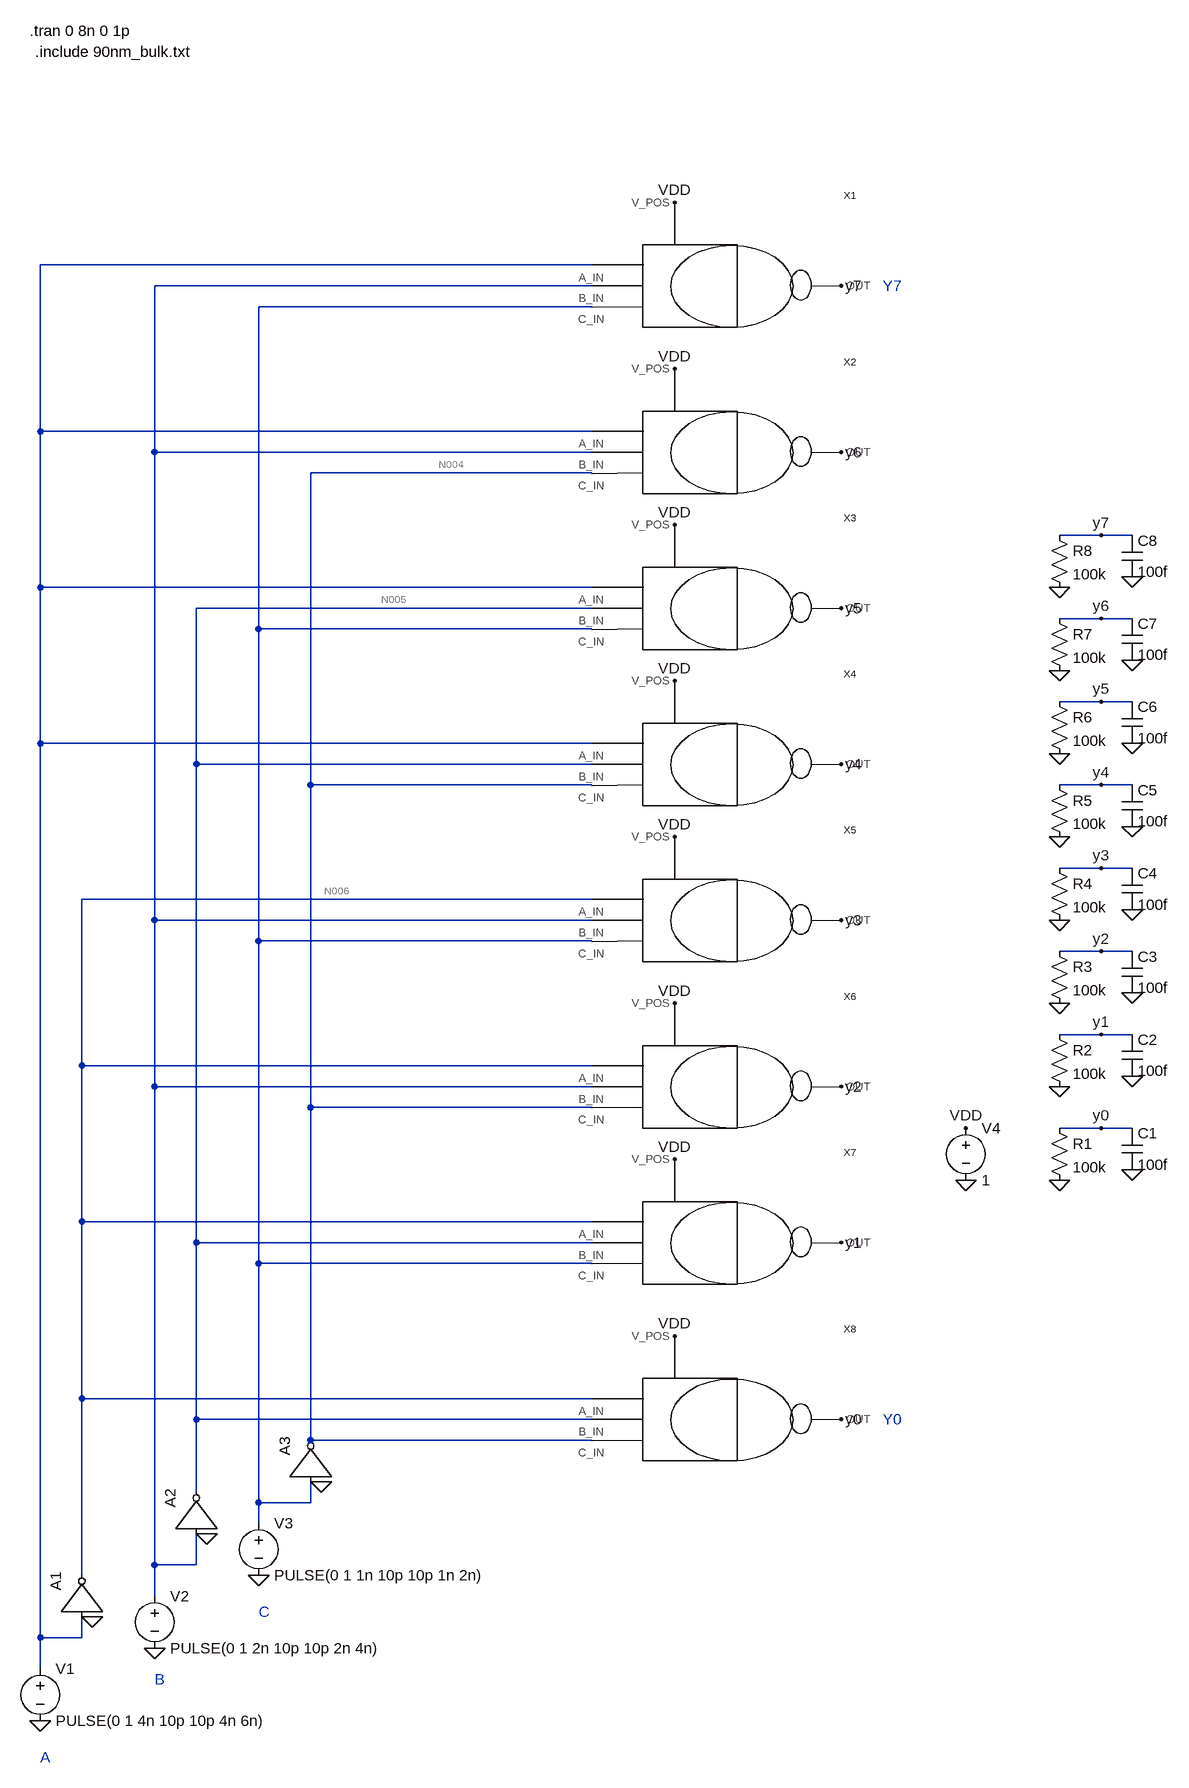
[diagram p0: schematic encoder.asc]
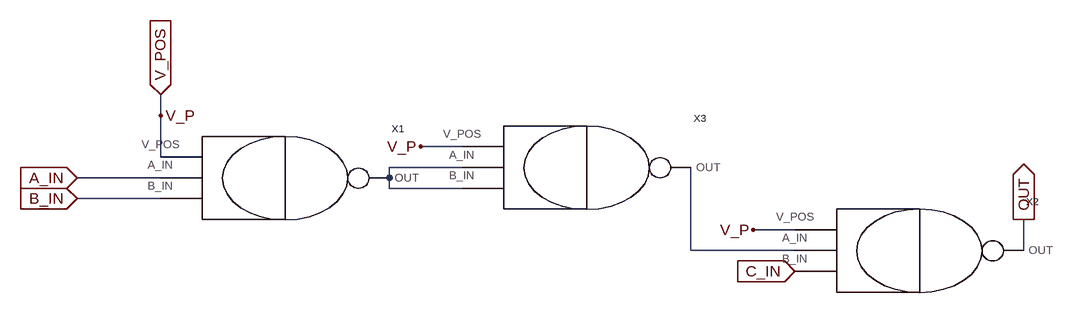
[diagram p1: sub-circuit nand3.asc]
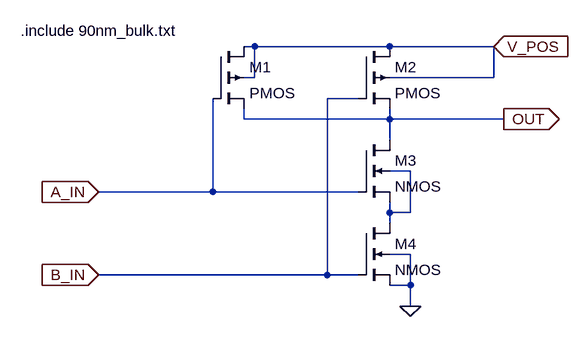
[diagram p2: sub-circuit nand.asc]
encoder.asc, the LTspice schematic file:
Version 4
SHEET 1 2432 2520
WIRE 1360 208 512 208
WIRE 1360 240 688 240
WIRE 1360 272 848 272
WIRE 512 464 512 208
WIRE 1360 464 512 464
WIRE 688 496 688 240
WIRE 1360 496 688 496
WIRE 1360 528 928 528
WIRE 2144 624 2080 624
WIRE 2192 624 2144 624
WIRE 512 704 512 464
WIRE 1360 704 512 704
WIRE 1360 736 752 736
WIRE 2144 752 2080 752
WIRE 2192 752 2144 752
WIRE 848 768 848 272
WIRE 1360 768 848 768
WIRE 2144 880 2080 880
WIRE 2192 880 2144 880
WIRE 512 944 512 704
WIRE 1360 944 512 944
WIRE 752 976 752 736
WIRE 1360 976 752 976
WIRE 928 1008 928 528
WIRE 1360 1008 928 1008
WIRE 2144 1008 2080 1008
WIRE 2192 1008 2144 1008
WIRE 2144 1136 2080 1136
WIRE 2192 1136 2144 1136
WIRE 1360 1184 576 1184
WIRE 688 1216 688 496
WIRE 1360 1216 688 1216
WIRE 848 1248 848 768
WIRE 1360 1248 848 1248
WIRE 2144 1264 2080 1264
WIRE 2192 1264 2144 1264
WIRE 2144 1392 2080 1392
WIRE 2192 1392 2144 1392
WIRE 576 1440 576 1184
WIRE 1360 1440 576 1440
WIRE 688 1472 688 1216
WIRE 1360 1472 688 1472
WIRE 928 1504 928 1008
WIRE 1360 1504 928 1504
WIRE 2144 1536 2080 1536
WIRE 2192 1536 2144 1536
WIRE 576 1680 576 1440
WIRE 1360 1680 576 1680
WIRE 752 1712 752 976
WIRE 1360 1712 752 1712
WIRE 848 1744 848 1248
WIRE 1360 1744 848 1744
WIRE 576 1952 576 1680
WIRE 1360 1952 576 1952
WIRE 752 1984 752 1712
WIRE 1360 1984 752 1984
WIRE 928 2016 928 1504
WIRE 1360 2016 928 2016
WIRE 752 2096 752 1984
WIRE 848 2112 848 1744
WIRE 928 2112 928 2080
WIRE 928 2112 848 2112
WIRE 848 2144 848 2112
WIRE 688 2208 688 1472
WIRE 752 2208 752 2160
WIRE 752 2208 688 2208
WIRE 576 2224 576 1952
WIRE 688 2256 688 2208
WIRE 512 2320 512 944
WIRE 576 2320 576 2288
WIRE 576 2320 512 2320
WIRE 512 2368 512 2320
FLAG 512 2448 0
FLAG 688 2336 0
FLAG 848 2224 0
FLAG 1936 1616 0
FLAG 1936 1536 VDD
FLAG 1488 1856 VDD
FLAG 1488 1584 VDD
FLAG 1488 1344 VDD
FLAG 1488 1088 VDD
FLAG 1488 848 VDD
FLAG 1488 608 VDD
FLAG 1488 368 VDD
FLAG 1488 112 VDD
FLAG 1744 240 y7
FLAG 1744 496 y6
FLAG 1744 736 y5
FLAG 1744 976 y4
FLAG 1744 1216 y3
FLAG 1744 1472 y2
FLAG 1744 1712 y1
FLAG 1744 1984 y0
FLAG 2080 704 0
FLAG 2080 832 0
FLAG 2080 960 0
FLAG 2080 1088 0
FLAG 2080 1216 0
FLAG 2080 1344 0
FLAG 2080 1472 0
FLAG 2080 1616 0
FLAG 2192 1600 0
FLAG 2192 1456 0
FLAG 2192 1328 0
FLAG 2192 1200 0
FLAG 2192 1072 0
FLAG 2192 944 0
FLAG 2192 816 0
FLAG 2192 688 0
FLAG 2144 1536 y0
FLAG 2144 1392 y1
FLAG 2144 1264 y2
FLAG 2144 1136 y3
FLAG 2144 1008 y4
FLAG 2144 880 y5
FLAG 2144 752 y6
FLAG 2144 624 y7
FLAG 592 2288 0
FLAG 768 2160 0
FLAG 944 2080 0
SYMBOL nand3 1520 240 R0
SYMATTR InstName X1
SYMBOL nand3 1520 496 R0
SYMATTR InstName X2
SYMBOL nand3 1520 736 R0
SYMATTR InstName X3
SYMBOL nand3 1520 976 R0
SYMATTR InstName X4
SYMBOL nand3 1520 1216 R0
SYMATTR InstName X5
SYMBOL nand3 1520 1472 R0
SYMATTR InstName X6
SYMBOL nand3 1520 1712 R0
SYMATTR InstName X7
SYMBOL nand3 1520 1984 R0
SYMATTR InstName X8
SYMBOL voltage 512 2352 R0
WINDOW 123 0 0 Left 0
WINDOW 39 0 0 Left 0
SYMATTR InstName V1
SYMATTR Value PULSE(0 1 4n 10p 10p 4n 6n)
SYMBOL voltage 688 2240 R0
WINDOW 123 0 0 Left 0
WINDOW 39 0 0 Left 0
SYMATTR InstName V2
SYMATTR Value PULSE(0 1 2n 10p 10p 2n 4n)
SYMBOL voltage 848 2128 R0
WINDOW 123 0 0 Left 0
WINDOW 39 0 0 Left 0
SYMATTR InstName V3
SYMATTR Value PULSE(0 1 1n 10p 10p 1n 2n)
SYMBOL Digital\\inv 512 2288 R270
SYMATTR InstName A1
SYMBOL Digital\\inv 688 2160 R270
SYMATTR InstName A2
SYMBOL Digital\\inv 864 2080 R270
SYMATTR InstName A3
SYMBOL voltage 1936 1520 R0
WINDOW 123 0 0 Left 0
WINDOW 39 0 0 Left 0
SYMATTR InstName V4
SYMATTR Value 1
SYMBOL res 2064 1520 R0
SYMATTR InstName R1
SYMATTR Value 100k
SYMBOL res 2064 1376 R0
SYMATTR InstName R2
SYMATTR Value 100k
SYMBOL res 2064 1248 R0
SYMATTR InstName R3
SYMATTR Value 100k
SYMBOL res 2064 1120 R0
SYMATTR InstName R4
SYMATTR Value 100k
SYMBOL res 2064 992 R0
SYMATTR InstName R5
SYMATTR Value 100k
SYMBOL res 2064 864 R0
SYMATTR InstName R6
SYMATTR Value 100k
SYMBOL res 2064 736 R0
SYMATTR InstName R7
SYMATTR Value 100k
SYMBOL res 2064 608 R0
SYMATTR InstName R8
SYMATTR Value 100k
SYMBOL cap 2176 1536 R0
SYMATTR InstName C1
SYMATTR Value 100f
SYMBOL cap 2176 1392 R0
SYMATTR InstName C2
SYMATTR Value 100f
SYMBOL cap 2176 1264 R0
SYMATTR InstName C3
SYMATTR Value 100f
SYMBOL cap 2176 1136 R0
SYMATTR InstName C4
SYMATTR Value 100f
SYMBOL cap 2176 1008 R0
SYMATTR InstName C5
SYMATTR Value 100f
SYMBOL cap 2176 880 R0
SYMATTR InstName C6
SYMATTR Value 100f
SYMBOL cap 2176 752 R0
SYMATTR InstName C7
SYMATTR Value 100f
SYMBOL cap 2176 624 R0
SYMATTR InstName C8
SYMATTR Value 100f
TEXT 512 2504 Left 2 ;A
TEXT 688 2384 Left 2 ;B
TEXT 848 2280 Left 2 ;C
TEXT 1808 1984 Left 2 ;Y0
TEXT 1808 240 Left 2 ;Y7
TEXT 496 -152 Left 2 !.tran 0 8n 0 1p
TEXT 504 -120 Left 2 !.include 90nm_bulk.txt

nand3.asc, the sub-circuit schematic file:
Version 4
SHEET 1 1272 680
WIRE -160 96 -160 64
WIRE 304 144 240 144
WIRE -160 160 -160 96
WIRE 304 176 192 176
WIRE -160 192 -288 192
WIRE 192 192 192 176
WIRE 192 208 192 192
WIRE 304 208 192 208
WIRE -160 224 -288 224
WIRE 816 272 752 272
WIRE 656 304 656 176
WIRE 816 304 656 304
WIRE 1168 304 1168 256
FLAG -160 64 V_POS
IOPIN -160 64 In
FLAG -288 192 A_IN
IOPIN -288 192 In
FLAG -288 224 B_IN
IOPIN -288 224 In
FLAG 816 336 C_IN
IOPIN 816 336 In
FLAG 1168 256 OUT
IOPIN 1168 256 Out
FLAG -160 96 V_P
FLAG 240 144 V_P
FLAG 752 272 V_P
SYMBOL nand -16 192 R0
SYMATTR InstName X1
SYMBOL nand 960 304 R0
SYMATTR InstName X2
SYMBOL nand 448 176 R0
SYMATTR InstName X3

nand.asc, the sub-circuit schematic file:
Version 4
SHEET 1 880 680
WIRE 96 48 80 48
WIRE 304 48 96 48
WIRE 464 48 304 48
WIRE 96 96 96 48
WIRE 96 96 80 96
WIRE 464 96 464 48
WIRE 464 96 304 96
WIRE 256 128 208 128
WIRE 80 160 80 144
WIRE 304 160 304 144
WIRE 304 160 80 160
WIRE 480 160 304 160
WIRE 304 192 304 160
WIRE 336 240 304 240
WIRE 32 272 32 128
WIRE 32 272 -144 272
WIRE 256 272 32 272
WIRE 304 304 304 288
WIRE 336 304 336 240
WIRE 336 304 304 304
WIRE 304 320 304 304
WIRE 336 368 304 368
WIRE 208 400 208 128
WIRE 208 400 -144 400
WIRE 256 400 208 400
WIRE 336 416 336 368
WIRE 336 416 304 416
WIRE 336 448 336 416
FLAG 464 48 V_POS
IOPIN 464 48 In
FLAG 480 160 OUT
IOPIN 480 160 Out
FLAG -144 272 A_IN
IOPIN -144 272 In
FLAG -144 400 B_IN
IOPIN -144 400 In
FLAG 336 448 0
SYMBOL pmos4 32 48 R0
SYMATTR InstName M1
SYMATTR Value2 l=90n w=400n
SYMBOL pmos4 256 48 R0
SYMATTR InstName M2
SYMATTR Value2 l=90n w=400n
SYMBOL nmos4 256 192 R0
SYMATTR InstName M3
SYMATTR Value2 l=90n w=200n
SYMBOL nmos4 256 320 R0
SYMATTR InstName M4
SYMATTR Value2 l=90n w=200n
TEXT -264 24 Left 2 !.include 90nm_bulk.txt

The netlist it stands for:
* encoder.asc
XX1 N001 N002 N003 VDD y7 nand3
XX2 N001 N002 N004 VDD y6 nand3
XX3 N001 N005 N003 VDD y5 nand3
XX4 N001 N005 N004 VDD y4 nand3
XX5 N006 N002 N003 VDD y3 nand3
XX6 N006 N002 N004 VDD y2 nand3
XX7 N006 N005 N003 VDD y1 nand3
XX8 N006 N005 N004 VDD y0 nand3
V1 N001 0 PULSE(0 1 4n 10p 10p 4n 6n)
V2 N002 0 PULSE(0 1 2n 10p 10p 2n 4n)
V3 N003 0 PULSE(0 1 1n 10p 10p 1n 2n)
A1 N001 0 0 0 0 N006 0 0 BUF
A2 N002 0 0 0 0 N005 0 0 BUF
A3 N003 0 0 0 0 N004 0 0 BUF
V4 VDD 0 1
R1 y0 0 100k
R2 y1 0 100k
R3 y2 0 100k
R4 y3 0 100k
R5 y4 0 100k
R6 y5 0 100k
R7 y6 0 100k
R8 y7 0 100k
C1 y0 0 100f
C2 y1 0 100f
C3 y2 0 100f
C4 y3 0 100f
C5 y4 0 100f
C6 y5 0 100f
C7 y6 0 100f
C8 y7 0 100f

* block symbol definitions
.subckt nand3 A_IN B_IN C_IN V_POS OUT
XX1 A_IN B_IN V_POS N001 nand
XX2 N002 C_IN V_POS OUT nand
XX3 N001 N001 V_POS N002 nand
.ends nand3

.subckt nand A_IN B_IN V_POS OUT
M1 V_POS A_IN OUT V_POS PMOS l=90n w=400n
M2 V_POS B_IN OUT V_POS PMOS l=90n w=400n
M3 OUT A_IN N001 N001 NMOS l=90n w=200n
M4 N001 B_IN 0 0 NMOS l=90n w=200n
.include 90nm_bulk.txt
.ends nand

.model NMOS NMOS
.model PMOS PMOS
.lib standard.mos
* A
* B
* C
* Y0
* Y7
.tran 0 8n 0 1p
.include 90nm_bulk.txt
.backanno
.end

* Results of the author's LTspice run, read from the files saved beside the schematic
* Operating Point, zero values left out:
*   V(vdd) = 1 V
*   V(y7) = 986.3 mV
*   V(y6) = 972.5 mV
*   V(n004) = 1 V
*   V(n005) = 1 V
*   V(y5) = 986.3 mV
*   V(y4) = 972.5 mV
*   V(n006) = 1 V
*   V(y3) = 986.3 mV
*   V(y2) = 972.5 mV
*   V(y1) = 972.5 mV
*   V(y0) = 44.05 µV
*   I(R8) = 9.863 µA
*   I(R7) = 9.725 µA
*   I(R6) = 9.863 µA
*   I(R5) = 9.725 µA
*   I(R4) = 9.863 µA
*   I(R3) = 9.725 µA
*   I(R2) = 9.725 µA
*   I(R1) = 440.5 pA
*   I(V4) = -68.67 µA
*   I(V3) = 84.69 pA
*   I(V2) = 162.1 pA
*   I(V1) = 523.6 pA
*   I8(A3) = 2.195 nA
*   I6(A3) = -2.195 nA
*   I8(A2) = 2.197 nA
*   I6(A2) = -2.197 nA
*   I8(A1) = 1.1 nA
*   I6(A1) = -1.1 nA
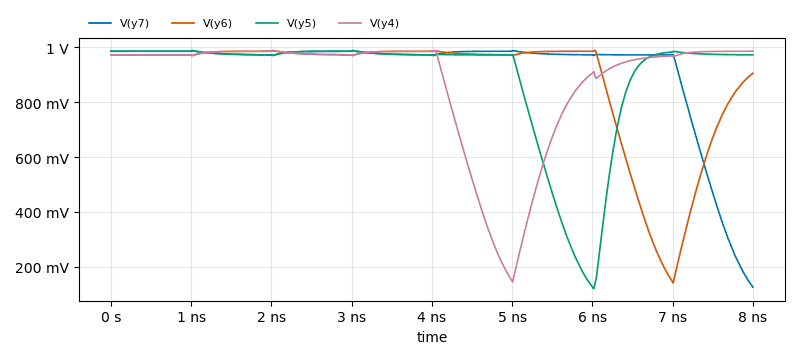
[diagram p3: Transient Analysis of encoder.asc, plotted from the saved traces]
* Transient Analysis, 1 run:
*   V(y7): min 125.3 mV, max 988.8 mV, average 919.3 mV, rms 937.6 mV, last 125.3 mV
*   V(y6): min 140.3 mV, max 989.4 mV, average 878.8 mV, rms 904.8 mV, last 906 mV
*   V(y5): min 119.1 mV, max 988.8 mV, average 891.5 mV, rms 916.2 mV, last 973 mV
*   V(y4): min 144 mV, max 989.2 mV, average 875.8 mV, rms 901.1 mV, last 986.2 mV